# Altium schematic sheet [03] POWER.SchDoc: Template
size A4; Author: Hom; CompanyName: KitSprout; DrawnBy: Hom; Engineer: Hom; Organization: KitSprout; Revision: A; SheetNumber: 3; SheetTotal: 6; Version: 0.0; LibVersion: 0.0
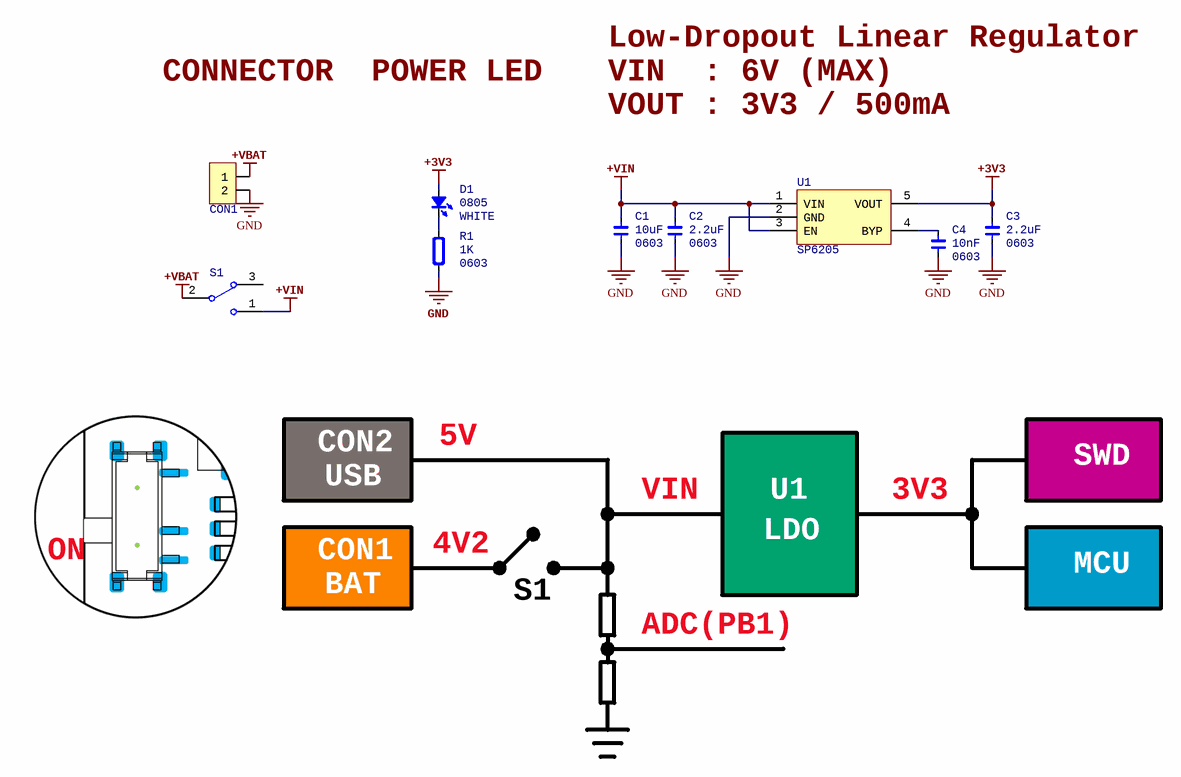
[diagram p0: [03] POWER.SchDoc]

## Parts
C1  Type: 0603  [CAP_0603]  (hidden comment: 10uF)
C2  Type: 0603  [CAP_0603]  (hidden comment: 2.2uF)
C3  Type: 0603  [CAP_0603]  (hidden comment: 2.2uF)
C4  Type: 0603  [CAP_0603]  (hidden comment: 10nF)
CON1  MX1.25_2P  [MX1.25_S90_2P]  (value not drawn)
D1  Type: 0805  [LED_0805_YELLOW]  (hidden comment: WHITE)
R1  Type: 0603  [RES_0603]  (hidden comment: 1K)
S1  SPDT 3P  [SwitchSPDT_2.8X6.6_90]  (value not drawn)
U1  SP6205  [SOT23-5]

## Nets
+3V3: C3.2 D1.1(A) U1.5(VOUT)
+VBAT: CON1.1 S1.2
+VIN: C1.2 C2.2 S1.1 U1.1(VIN) U1.3(EN)
GND: C1.1 C2.1 C3.1 C4.1 CON1.2 R1.1 U1.2(GND)
NetC4_2: C4.2 U1.4(BYP)
NetD1_2: D1.2(K) R1.2

Not connected (* = marked no-connect by the designer): S1 3

## Notes on the sheet
- CONNECTOR
- POWER LED
- Low-Dropout Linear Regulator
- VIN  : 6V (MAX)
- VOUT : 3V3 / 500mA
- CON2
- USB
- 5V
- SWD
- VIN
- LDO
- U1
- 3V3
- ON
- CON1
- BAT
- 4V2
- S1
- MCU
- ADC(PB1)

## Library data of the parts
C1-C4 = Cap_0603: Capacitor
  C1: Value: 10uF
  C2 C3: Value: 2.2uF
  C4: Value: 10nF
CON1 = MX1.25_2P: MX
D1 = LED_0805: LED; Value: WHITE
R1 = Res_0603: Resistor; Value: 1K
S1 = SwitchSPDT_2.8x6.6_90: Switch; Value: SPDT 3P; Type: SPDT
U1 = SP6205: Power; Type: SOT23-5